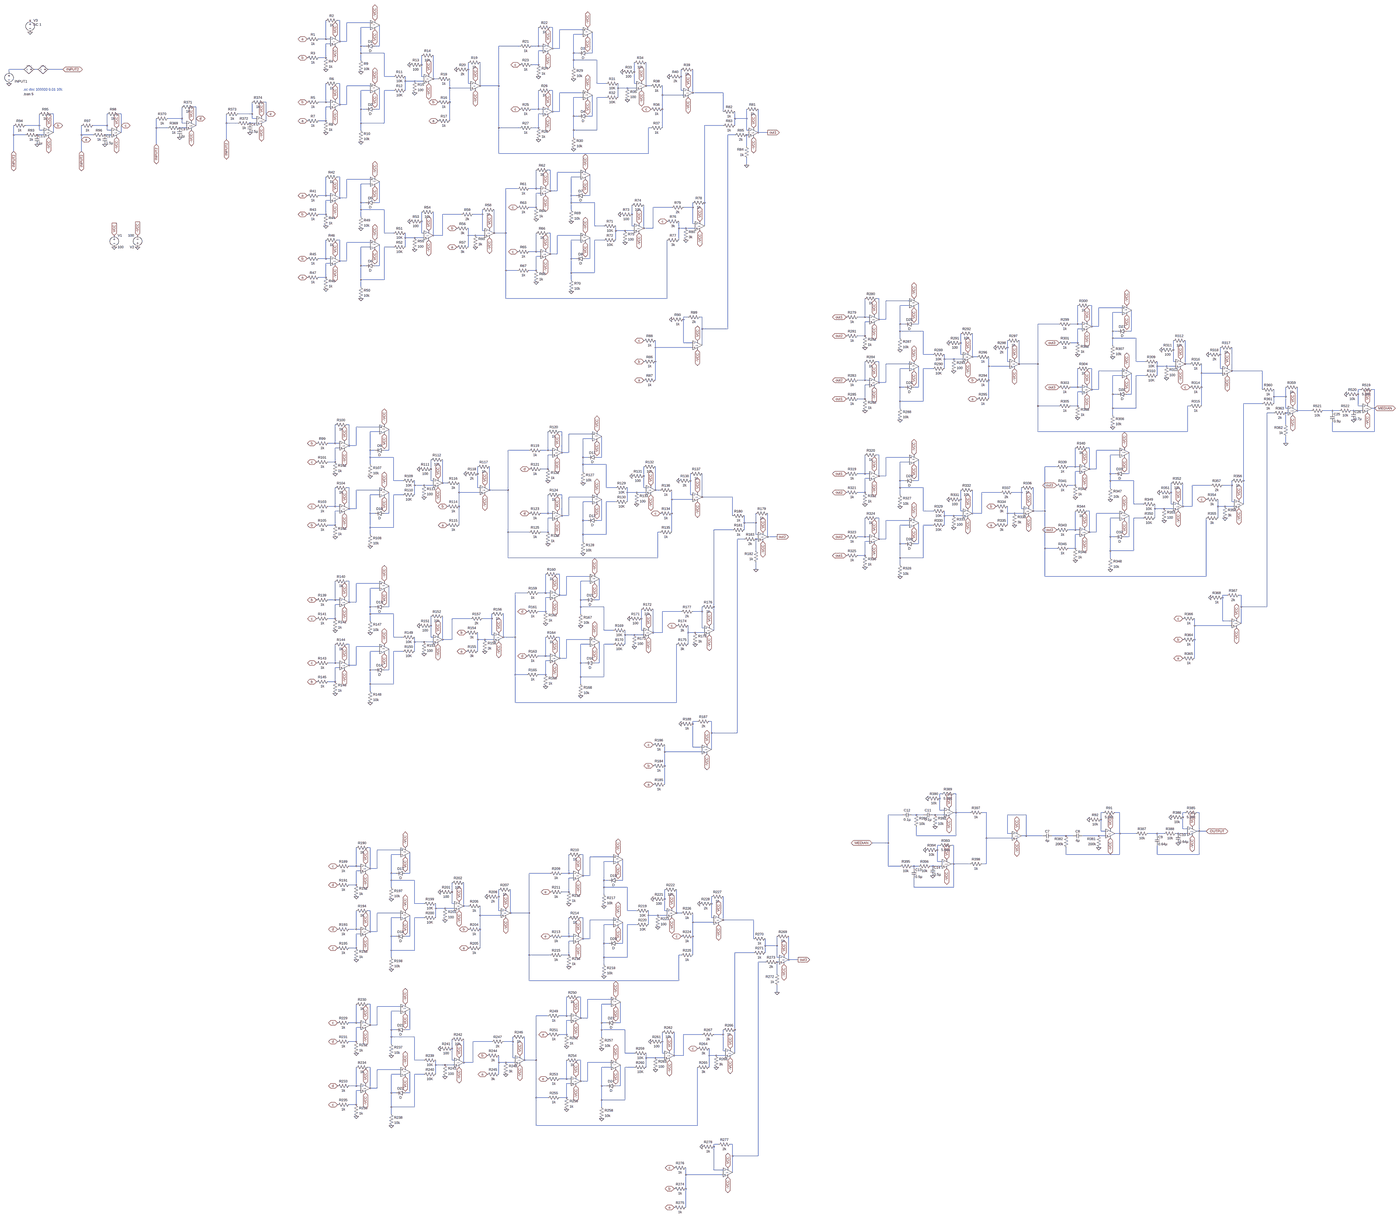
[diagram p0: schematic Final Circuit.asc, whole sheet]
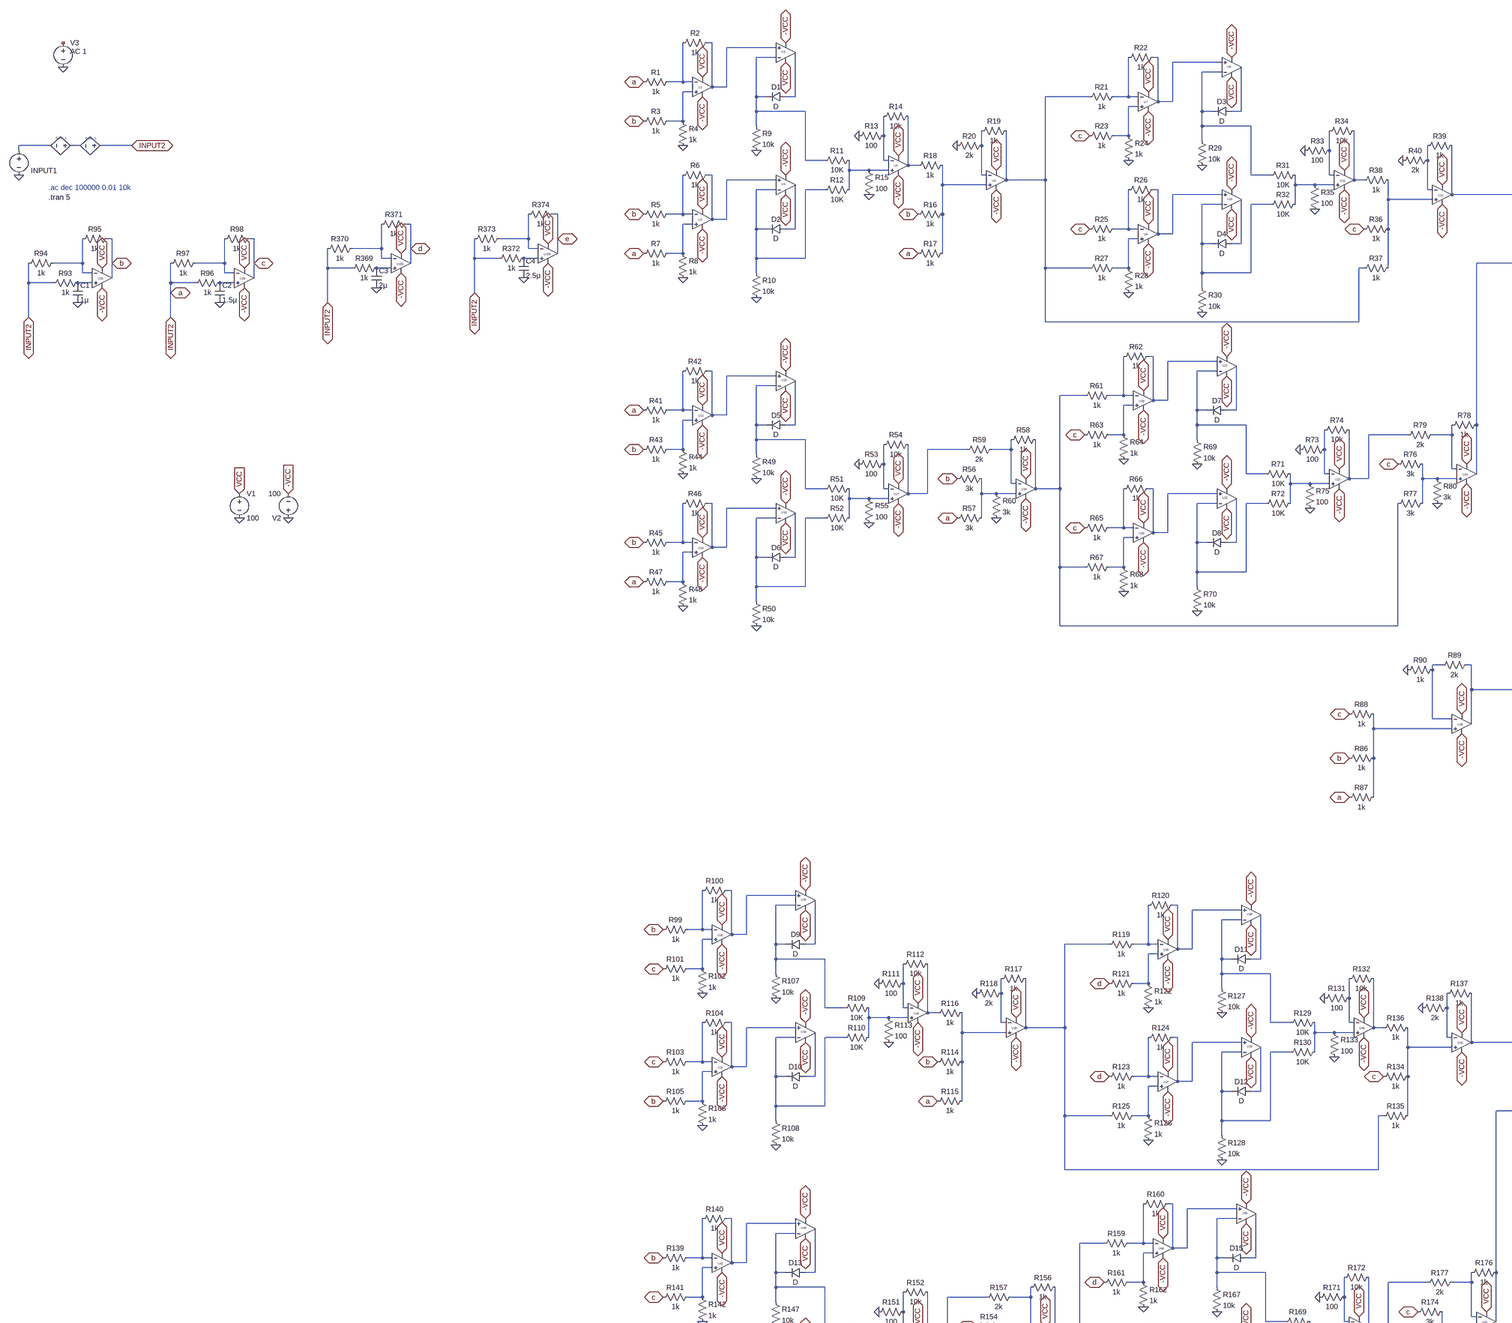
[diagram p1: schematic Final Circuit.asc, part, row 1 of 2, column 1 of 2]
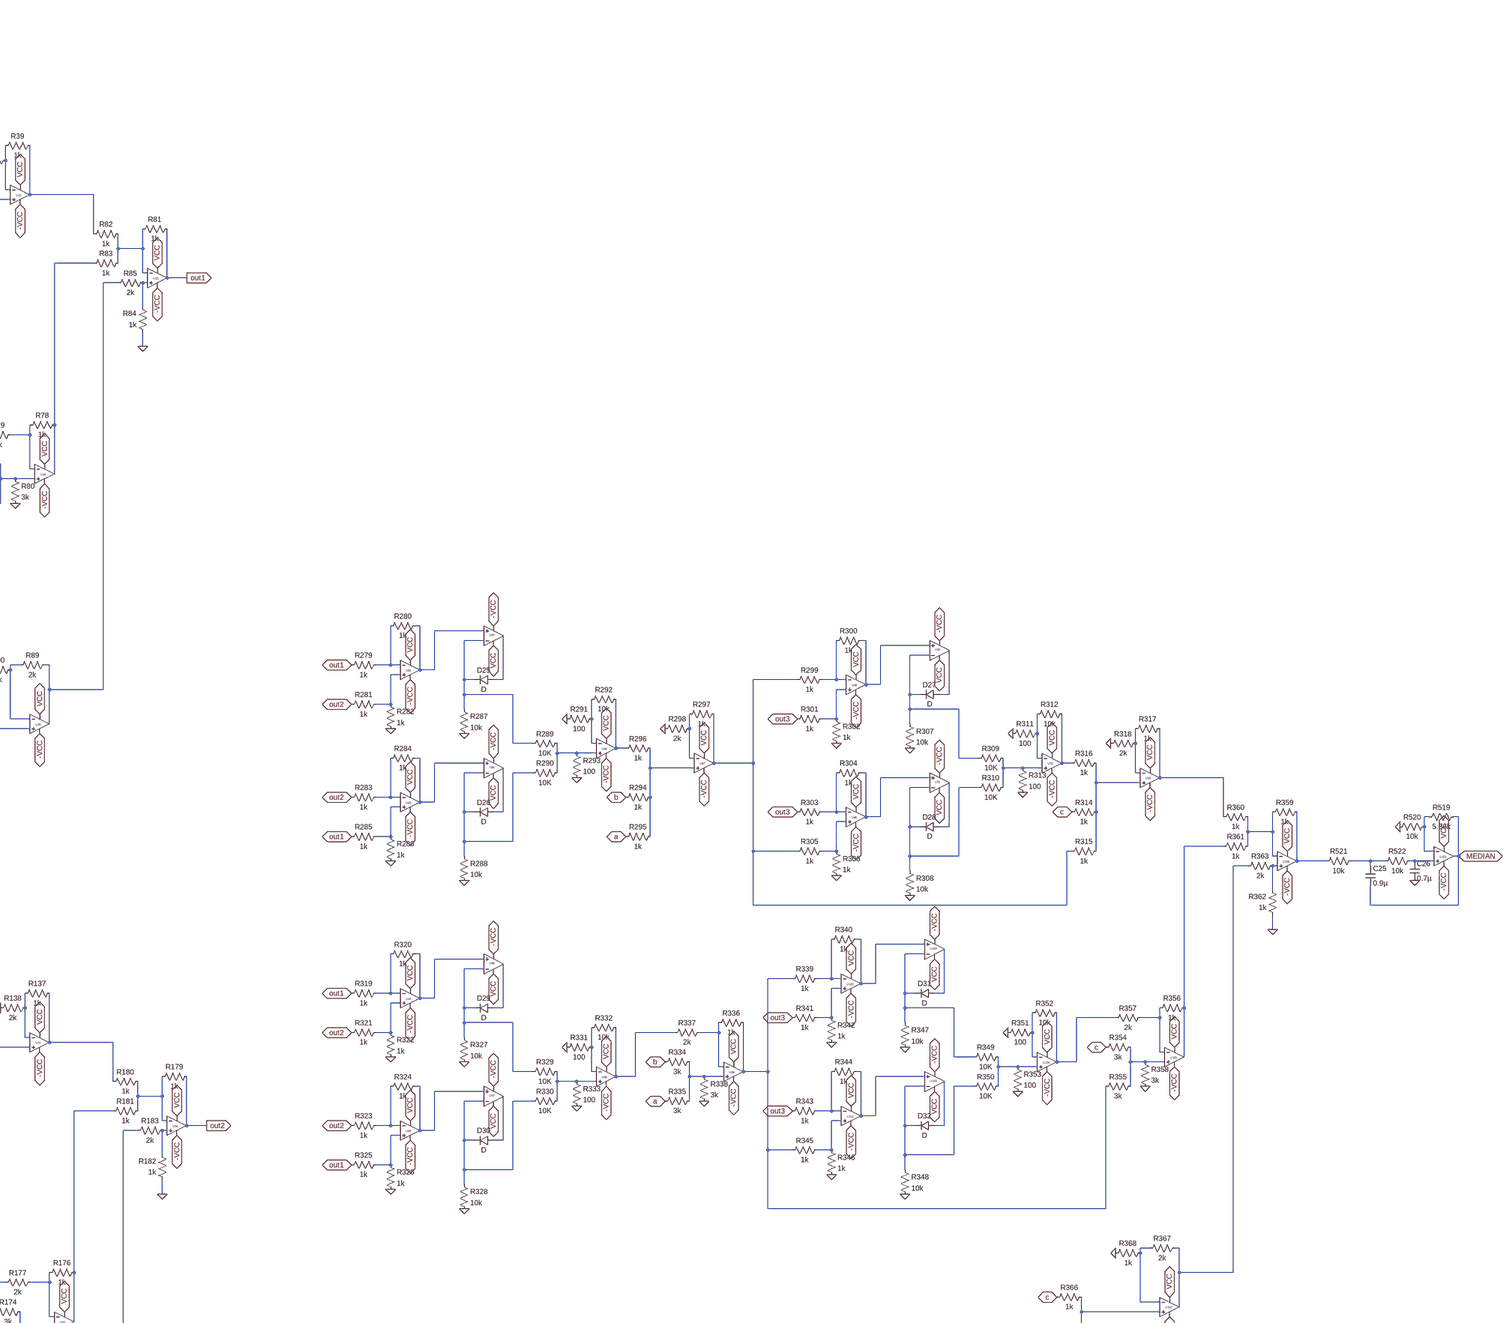
[diagram p2: schematic Final Circuit.asc, part, row 1 of 2, column 2 of 2]
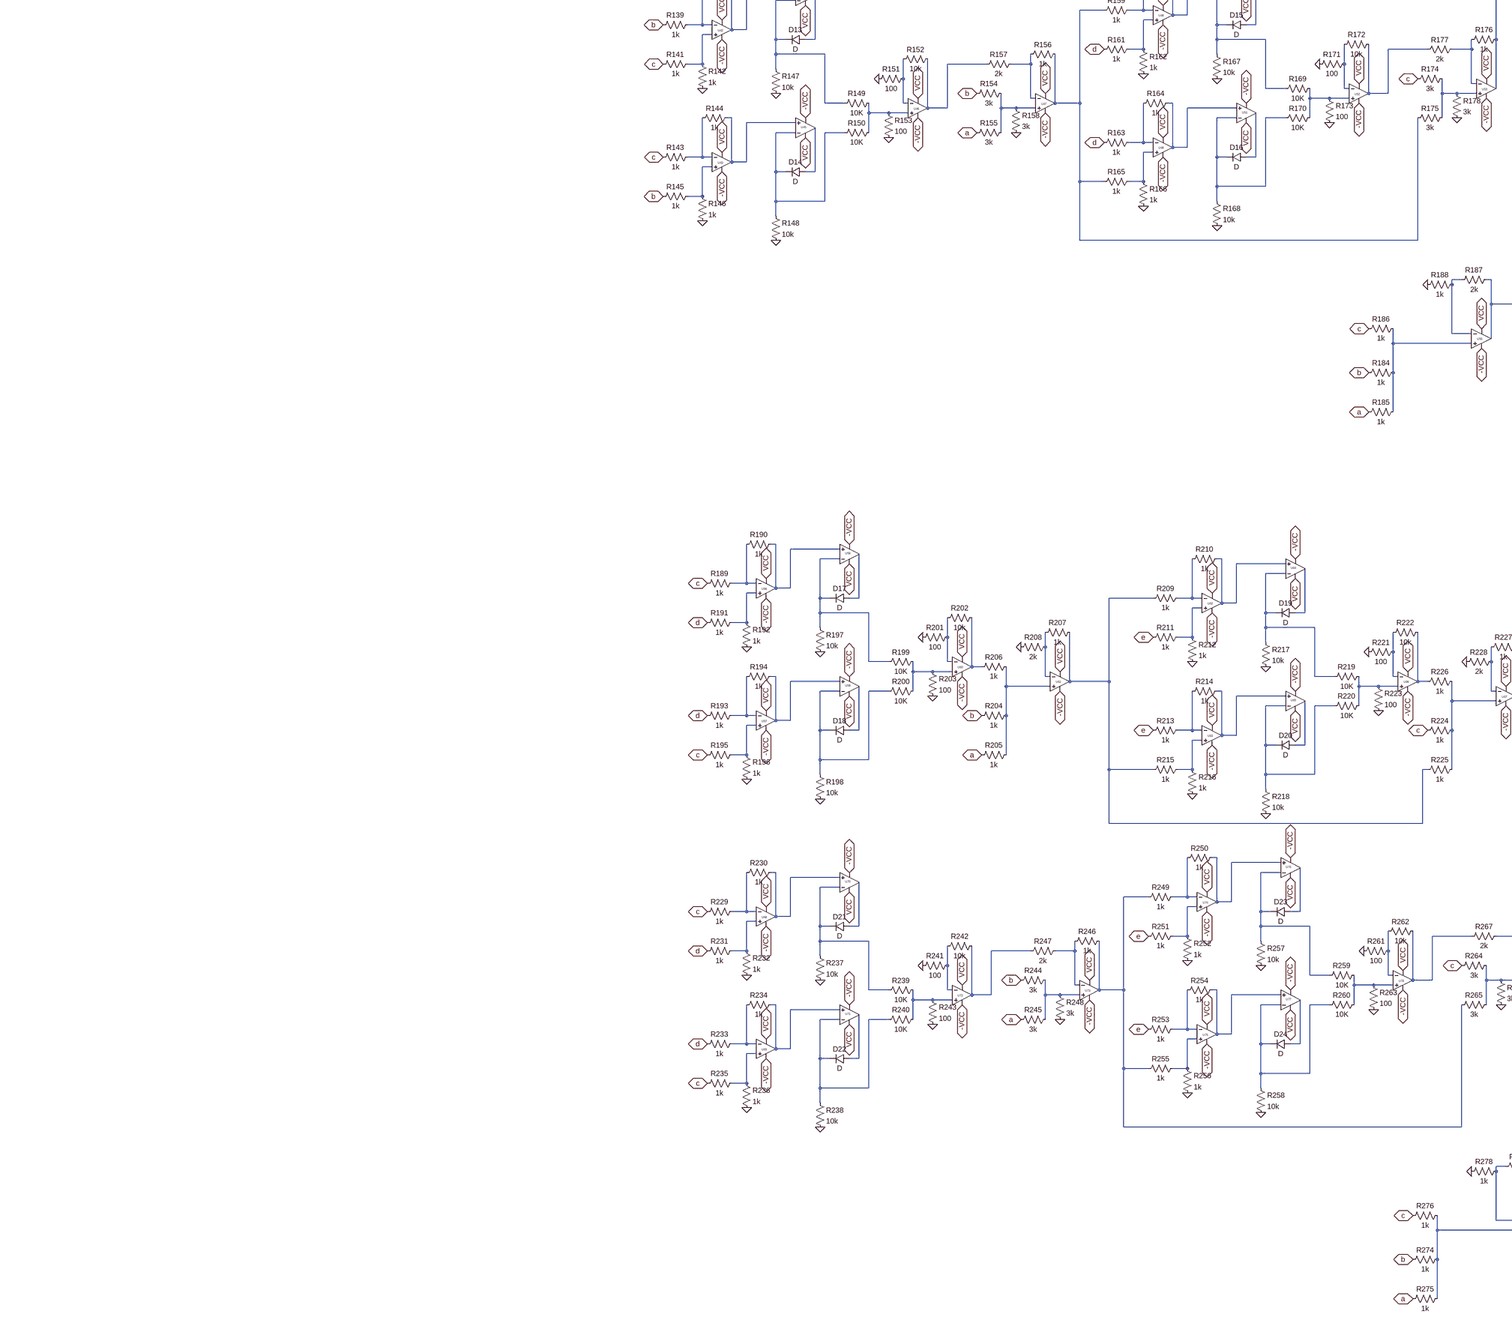
[diagram p3: schematic Final Circuit.asc, part, row 2 of 2, column 1 of 2]
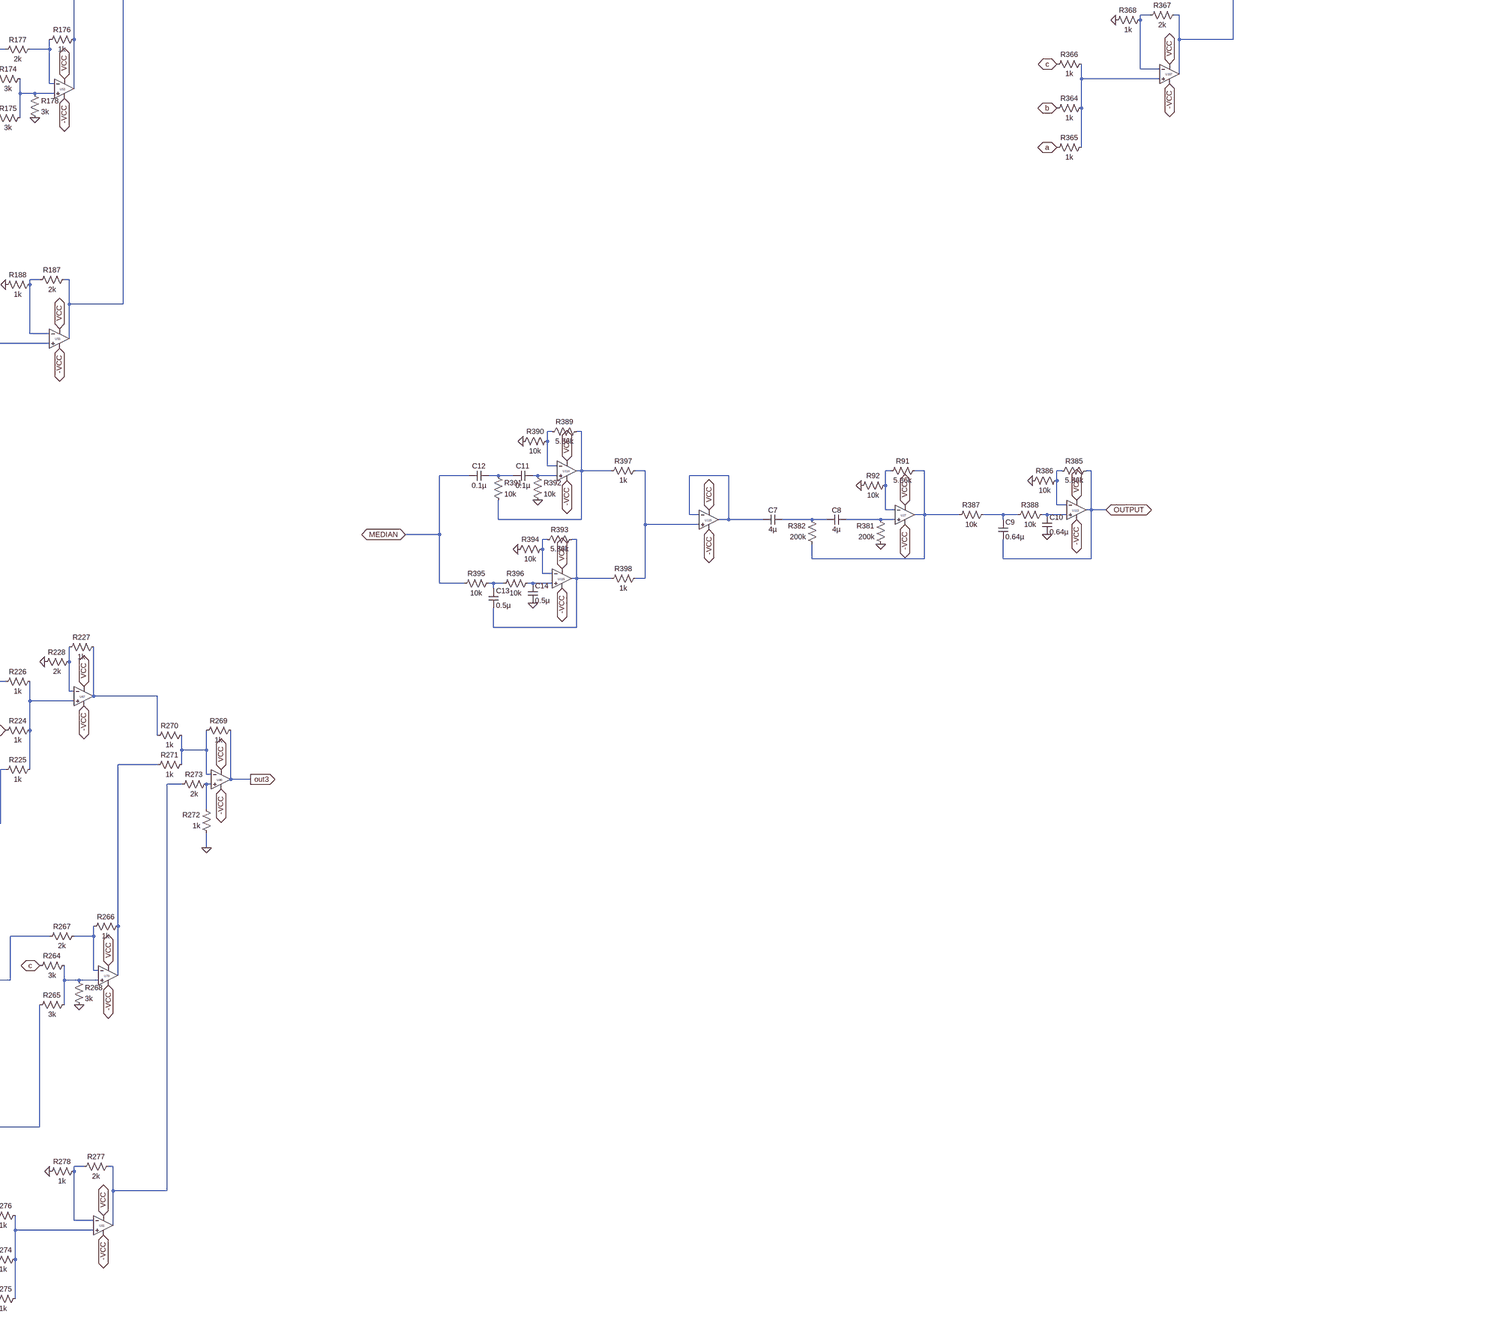
[diagram p4: schematic Final Circuit.asc, part, row 2 of 2, column 2 of 2]
* Final Circuit.asc
V1 VCC 0 100
V2 0 -VCC 100
XU1 N006 N005 VCC -VCC N001 level2 Avol=1Meg GBW=10Meg Slew=10Meg Ilimit=25m Rail=0 Vos=0 En=0 Enk=0 In=0 Ink=0 Rin=500Meg  ; pins In+ In- V+ V- OUT
R1 N005 INPUT2 1k
R2 N001 N005 1k
R3 N006 b 1k
R4 N006 0 1k
XU2 N030 N029 VCC -VCC N020 level2 Avol=1Meg GBW=10Meg Slew=10Meg Ilimit=25m Rail=0 Vos=0 En=0 Enk=0 In=0 Ink=0 Rin=500Meg  ; pins In+ In- V+ V- OUT
R5 N029 b 1k
R6 N020 N029 1k
R7 N030 INPUT2 1k
R8 N030 0 1k
XU3 N001 N002 VCC -VCC N007 level2 Avol=1Meg GBW=10Meg Slew=10Meg Ilimit=25m Rail=0 Vos=0 En=0 Enk=0 In=0 Ink=0 Rin=500Meg  ; pins In+ In- V+ V- OUT
R9 N002 0 10k
D1 N007 N002 D
XU4 N020 N024 VCC -VCC N031 level2 Avol=1Meg GBW=10Meg Slew=10Meg Ilimit=25m Rail=0 Vos=0 En=0 Enk=0 In=0 Ink=0 Rin=500Meg  ; pins In+ In- V+ V- OUT
R10 N024 0 10k
D2 N031 N024 D
R11 N019 N002 10K
R12 N019 N024 10K
XU5 N019 N012 VCC -VCC N018 level2 Avol=1Meg GBW=10Meg Slew=10Meg Ilimit=25m Rail=0 Vos=0 En=0 Enk=0 In=0 Ink=0 Rin=500Meg  ; pins In+ In- V+ V- OUT
R13 N012 0 100
R14 N018 N012 10k
R15 N019 0 100
R16 N022 b 1k
R17 N022 INPUT2 1k
R18 N022 N018 1k
XU6 N022 N015 VCC -VCC N008 level2 Avol=1Meg GBW=10Meg Slew=10Meg Ilimit=25m Rail=0 Vos=0 En=0 Enk=0 In=0 Ink=0 Rin=500Meg  ; pins In+ In- V+ V- OUT
R19 N008 N015 1k
R20 N015 0 2k
XU7 N010 N009 VCC -VCC N003 level2 Avol=1Meg GBW=10Meg Slew=10Meg Ilimit=25m Rail=0 Vos=0 En=0 Enk=0 In=0 Ink=0 Rin=500Meg  ; pins In+ In- V+ V- OUT
R21 N009 N008 1k
R22 N003 N009 1k
R23 N010 c 1k
R24 N010 0 1k
XU8 N034 N032 VCC -VCC N025 level2 Avol=1Meg GBW=10Meg Slew=10Meg Ilimit=25m Rail=0 Vos=0 En=0 Enk=0 In=0 Ink=0 Rin=500Meg  ; pins In+ In- V+ V- OUT
R25 N032 c 1k
R26 N025 N032 1k
R27 N034 N008 1k
R28 N034 0 1k
XU9 N003 N004 VCC -VCC N011 level2 Avol=1Meg GBW=10Meg Slew=10Meg Ilimit=25m Rail=0 Vos=0 En=0 Enk=0 In=0 Ink=0 Rin=500Meg  ; pins In+ In- V+ V- OUT
R29 N004 0 10k
D3 N011 N004 D
XU10 N025 N028 VCC -VCC N035 level2 Avol=1Meg GBW=10Meg Slew=10Meg Ilimit=25m Rail=0 Vos=0 En=0 Enk=0 In=0 Ink=0 Rin=500Meg  ; pins In+ In- V+ V- OUT
R30 N028 0 10k
D4 N035 N028 D
R31 N023 N004 10K
R32 N023 N028 10K
XU11 N023 N016 VCC -VCC N021 level2 Avol=1Meg GBW=10Meg Slew=10Meg Ilimit=25m Rail=0 Vos=0 En=0 Enk=0 In=0 Ink=0 Rin=500Meg  ; pins In+ In- V+ V- OUT
R33 N016 0 100
R34 N021 N016 10k
R35 N023 0 100
R36 N027 c 1k
R37 N027 N008 1k
R38 N027 N021 1k
XU12 N027 N017 VCC -VCC N026 level2 Avol=1Meg GBW=10Meg Slew=10Meg Ilimit=25m Rail=0 Vos=0 En=0 Enk=0 In=0 Ink=0 Rin=500Meg  ; pins In+ In- V+ V- OUT
R39 N026 N017 1k
R40 N017 0 2k
XU13 N056 N054 VCC -VCC N048 level2 Avol=1Meg GBW=10Meg Slew=10Meg Ilimit=25m Rail=0 Vos=0 En=0 Enk=0 In=0 Ink=0 Rin=500Meg  ; pins In+ In- V+ V- OUT
R41 N054 INPUT2 1k
R42 N048 N054 1k
R43 N056 b 1k
R44 N056 0 1k
XU14 N076 N074 VCC -VCC N069 level2 Avol=1Meg GBW=10Meg Slew=10Meg Ilimit=25m Rail=0 Vos=0 En=0 Enk=0 In=0 Ink=0 Rin=500Meg  ; pins In+ In- V+ V- OUT
R45 N074 b 1k
R46 N069 N074 1k
R47 N076 INPUT2 1k
R48 N076 0 1k
XU15 N048 N050 VCC -VCC N057 level2 Avol=1Meg GBW=10Meg Slew=10Meg Ilimit=25m Rail=0 Vos=0 En=0 Enk=0 In=0 Ink=0 Rin=500Meg  ; pins In+ In- V+ V- OUT
R49 N050 0 10k
D5 N057 N050 D
XU16 N069 N071 VCC -VCC N077 level2 Avol=1Meg GBW=10Meg Slew=10Meg Ilimit=25m Rail=0 Vos=0 En=0 Enk=0 In=0 Ink=0 Rin=500Meg  ; pins In+ In- V+ V- OUT
R50 N071 0 10k
D6 N077 N071 D
R51 N068 N050 10K
R52 N068 N071 10K
XU17 N068 N063 VCC -VCC N060 level2 Avol=1Meg GBW=10Meg Slew=10Meg Ilimit=25m Rail=0 Vos=0 En=0 Enk=0 In=0 Ink=0 Rin=500Meg  ; pins In+ In- V+ V- OUT
R53 N063 0 100
R54 N060 N063 10k
R55 N068 0 100
R56 N067 b 3k
R57 N067 INPUT2 3k
XU18 N067 N061 VCC -VCC N051 level2 Avol=1Meg GBW=10Meg Slew=10Meg Ilimit=25m Rail=0 Vos=0 En=0 Enk=0 In=0 Ink=0 Rin=500Meg  ; pins In+ In- V+ V- OUT
R58 N051 N061 1k
R59 N061 N060 2k
R60 N067 0 3k
XU19 N053 N052 VCC -VCC N047 level2 Avol=1Meg GBW=10Meg Slew=10Meg Ilimit=25m Rail=0 Vos=0 En=0 Enk=0 In=0 Ink=0 Rin=500Meg  ; pins In+ In- V+ V- OUT
R61 N052 N051 1k
R62 N047 N052 1k
R63 N053 c 1k
R64 N053 0 1k
XU20 N073 N072 VCC -VCC N066 level2 Avol=1Meg GBW=10Meg Slew=10Meg Ilimit=25m Rail=0 Vos=0 En=0 Enk=0 In=0 Ink=0 Rin=500Meg  ; pins In+ In- V+ V- OUT
R65 N072 c 1k
R66 N066 N072 1k
R67 N073 N051 1k
R68 N073 0 1k
XU21 N047 N049 VCC -VCC N055 level2 Avol=1Meg GBW=10Meg Slew=10Meg Ilimit=25m Rail=0 Vos=0 En=0 Enk=0 In=0 Ink=0 Rin=500Meg  ; pins In+ In- V+ V- OUT
R69 N049 0 10k
D7 N055 N049 D
XU22 N066 N070 VCC -VCC N075 level2 Avol=1Meg GBW=10Meg Slew=10Meg Ilimit=25m Rail=0 Vos=0 En=0 Enk=0 In=0 Ink=0 Rin=500Meg  ; pins In+ In- V+ V- OUT
R70 N070 0 10k
D8 N075 N070 D
R71 N065 N049 10K
R72 N065 N070 10K
XU23 N065 N062 VCC -VCC N058 level2 Avol=1Meg GBW=10Meg Slew=10Meg Ilimit=25m Rail=0 Vos=0 En=0 Enk=0 In=0 Ink=0 Rin=500Meg  ; pins In+ In- V+ V- OUT
R73 N062 0 100
R74 N058 N062 10k
R75 N065 0 100
R76 N064 c 3k
R77 N064 N051 3k
XU24 N064 N059 VCC -VCC N041 level2 Avol=1Meg GBW=10Meg Slew=10Meg Ilimit=25m Rail=0 Vos=0 En=0 Enk=0 In=0 Ink=0 Rin=500Meg  ; pins In+ In- V+ V- OUT
R78 N041 N059 1k
R79 N059 N058 2k
R80 N064 0 3k
XU25 N046 N037 VCC -VCC out1 level2 Avol=1Meg GBW=10Meg Slew=10Meg Ilimit=25m Rail=0 Vos=0 En=0 Enk=0 In=0 Ink=0 Rin=500Meg  ; pins In+ In- V+ V- OUT
R81 out1 N037 1k
R82 N037 N026 1k
R83 N037 N041 1k
R84 0 N046 1k
R85 N046 N045 2k
XU26 N091 N082 VCC -VCC N045 level2 Avol=1Meg GBW=10Meg Slew=10Meg Ilimit=25m Rail=0 Vos=0 En=0 Enk=0 In=0 Ink=0 Rin=500Meg  ; pins In+ In- V+ V- OUT
R86 N091 b 1k
R87 N091 INPUT2 1k
R88 N091 c 1k
R89 N045 N082 2k
R90 N082 0 1k
XU28 N043 N039 VCC -VCC b level2 Avol=1Meg GBW=10Meg Slew=10Meg Ilimit=25m Rail=0 Vos=0 En=0 Enk=0 In=0 Ink=0 Rin=500Meg  ; pins In+ In- V+ V- OUT
R93 N043 INPUT2 1k
C1 N043 0 1µ
R94 N039 INPUT2 1k
R95 b N039 1k
XU29 N044 N040 VCC -VCC c level2 Avol=1Meg GBW=10Meg Slew=10Meg Ilimit=25m Rail=0 Vos=0 En=0 Enk=0 In=0 Ink=0 Rin=500Meg  ; pins In+ In- V+ V- OUT
R96 N044 INPUT2 1k
C2 N044 0 1.5µ
R97 N040 INPUT2 1k
R98 c N040 1k
XU30 N125 N124 VCC -VCC N120 level2 Avol=1Meg GBW=10Meg Slew=10Meg Ilimit=25m Rail=0 Vos=0 En=0 Enk=0 In=0 Ink=0 Rin=500Meg  ; pins In+ In- V+ V- OUT
R99 N124 b 1k
R100 N120 N124 1k
R101 N125 c 1k
R102 N125 0 1k
XU31 N166 N163 VCC -VCC N150 level2 Avol=1Meg GBW=10Meg Slew=10Meg Ilimit=25m Rail=0 Vos=0 En=0 Enk=0 In=0 Ink=0 Rin=500Meg  ; pins In+ In- V+ V- OUT
R103 N163 c 1k
R104 N150 N163 1k
R105 N166 b 1k
R106 N166 0 1k
XU32 N120 N121 VCC -VCC N127 level2 Avol=1Meg GBW=10Meg Slew=10Meg Ilimit=25m Rail=0 Vos=0 En=0 Enk=0 In=0 Ink=0 Rin=500Meg  ; pins In+ In- V+ V- OUT
R107 N121 0 10k
D9 N127 N121 D
XU33 N150 N157 VCC -VCC N168 level2 Avol=1Meg GBW=10Meg Slew=10Meg Ilimit=25m Rail=0 Vos=0 En=0 Enk=0 In=0 Ink=0 Rin=500Meg  ; pins In+ In- V+ V- OUT
R108 N157 0 10k
D10 N168 N157 D
R109 N147 N121 10K
R110 N147 N157 10K
XU34 N147 N137 VCC -VCC N146 level2 Avol=1Meg GBW=10Meg Slew=10Meg Ilimit=25m Rail=0 Vos=0 En=0 Enk=0 In=0 Ink=0 Rin=500Meg  ; pins In+ In- V+ V- OUT
R111 N137 0 100
R112 N146 N137 10k
R113 N147 0 100
R114 N152 b 1k
R115 N152 INPUT2 1k
R116 N152 N146 1k
XU35 N152 N139 VCC -VCC N128 level2 Avol=1Meg GBW=10Meg Slew=10Meg Ilimit=25m Rail=0 Vos=0 En=0 Enk=0 In=0 Ink=0 Rin=500Meg  ; pins In+ In- V+ V- OUT
R117 N128 N139 1k
R118 N139 0 2k
XU36 N130 N129 VCC -VCC N122 level2 Avol=1Meg GBW=10Meg Slew=10Meg Ilimit=25m Rail=0 Vos=0 En=0 Enk=0 In=0 Ink=0 Rin=500Meg  ; pins In+ In- V+ V- OUT
R119 N129 N128 1k
R120 N122 N129 1k
R121 N130 d 1k
R122 N130 0 1k
XU37 N172 N169 VCC -VCC N158 level2 Avol=1Meg GBW=10Meg Slew=10Meg Ilimit=25m Rail=0 Vos=0 En=0 Enk=0 In=0 Ink=0 Rin=500Meg  ; pins In+ In- V+ V- OUT
R123 N169 d 1k
R124 N158 N169 1k
R125 N172 N128 1k
R126 N172 0 1k
XU38 N122 N123 VCC -VCC N133 level2 Avol=1Meg GBW=10Meg Slew=10Meg Ilimit=25m Rail=0 Vos=0 En=0 Enk=0 In=0 Ink=0 Rin=500Meg  ; pins In+ In- V+ V- OUT
R127 N123 0 10k
D11 N133 N123 D
XU39 N158 N162 VCC -VCC N175 level2 Avol=1Meg GBW=10Meg Slew=10Meg Ilimit=25m Rail=0 Vos=0 En=0 Enk=0 In=0 Ink=0 Rin=500Meg  ; pins In+ In- V+ V- OUT
R128 N162 0 10k
D12 N175 N162 D
R129 N153 N123 10K
R130 N153 N162 10K
XU40 N153 N142 VCC -VCC N151 level2 Avol=1Meg GBW=10Meg Slew=10Meg Ilimit=25m Rail=0 Vos=0 En=0 Enk=0 In=0 Ink=0 Rin=500Meg  ; pins In+ In- V+ V- OUT
R131 N142 0 100
R132 N151 N142 10k
R133 N153 0 100
R134 N160 c 1k
R135 N160 N128 1k
R136 N160 N151 1k
XU41 N160 N144 VCC -VCC N159 level2 Avol=1Meg GBW=10Meg Slew=10Meg Ilimit=25m Rail=0 Vos=0 En=0 Enk=0 In=0 Ink=0 Rin=500Meg  ; pins In+ In- V+ V- OUT
R137 N159 N144 1k
R138 N144 0 2k
XU42 N197 N195 VCC -VCC N188 level2 Avol=1Meg GBW=10Meg Slew=10Meg Ilimit=25m Rail=0 Vos=0 En=0 Enk=0 In=0 Ink=0 Rin=500Meg  ; pins In+ In- V+ V- OUT
R139 N195 b 1k
R140 N188 N195 1k
R141 N197 c 1k
R142 N197 0 1k
XU43 N218 N216 VCC -VCC N211 level2 Avol=1Meg GBW=10Meg Slew=10Meg Ilimit=25m Rail=0 Vos=0 En=0 Enk=0 In=0 Ink=0 Rin=500Meg  ; pins In+ In- V+ V- OUT
R143 N216 c 1k
R144 N211 N216 1k
R145 N218 b 1k
R146 N218 0 1k
XU44 N188 N190 VCC -VCC N198 level2 Avol=1Meg GBW=10Meg Slew=10Meg Ilimit=25m Rail=0 Vos=0 En=0 Enk=0 In=0 Ink=0 Rin=500Meg  ; pins In+ In- V+ V- OUT
R147 N190 0 10k
D13 N198 N190 D
XU45 N211 N213 VCC -VCC N219 level2 Avol=1Meg GBW=10Meg Slew=10Meg Ilimit=25m Rail=0 Vos=0 En=0 Enk=0 In=0 Ink=0 Rin=500Meg  ; pins In+ In- V+ V- OUT
R148 N213 0 10k
D14 N219 N213 D
R149 N210 N190 10K
R150 N210 N213 10K
XU46 N210 N204 VCC -VCC N201 level2 Avol=1Meg GBW=10Meg Slew=10Meg Ilimit=25m Rail=0 Vos=0 En=0 Enk=0 In=0 Ink=0 Rin=500Meg  ; pins In+ In- V+ V- OUT
R151 N204 0 100
R152 N201 N204 10k
R153 N210 0 100
R154 N209 b 3k
R155 N209 INPUT2 3k
XU47 N209 N202 VCC -VCC N191 level2 Avol=1Meg GBW=10Meg Slew=10Meg Ilimit=25m Rail=0 Vos=0 En=0 Enk=0 In=0 Ink=0 Rin=500Meg  ; pins In+ In- V+ V- OUT
R156 N191 N202 1k
R157 N202 N201 2k
R158 N209 0 3k
XU48 N194 N192 VCC -VCC N187 level2 Avol=1Meg GBW=10Meg Slew=10Meg Ilimit=25m Rail=0 Vos=0 En=0 Enk=0 In=0 Ink=0 Rin=500Meg  ; pins In+ In- V+ V- OUT
R159 N192 N191 1k
R160 N187 N192 1k
R161 N194 d 1k
R162 N194 0 1k
XU49 N215 N214 VCC -VCC N208 level2 Avol=1Meg GBW=10Meg Slew=10Meg Ilimit=25m Rail=0 Vos=0 En=0 Enk=0 In=0 Ink=0 Rin=500Meg  ; pins In+ In- V+ V- OUT
R163 N214 d 1k
R164 N208 N214 1k
R165 N215 N191 1k
R166 N215 0 1k
XU50 N187 N189 VCC -VCC N196 level2 Avol=1Meg GBW=10Meg Slew=10Meg Ilimit=25m Rail=0 Vos=0 En=0 Enk=0 In=0 Ink=0 Rin=500Meg  ; pins In+ In- V+ V- OUT
R167 N189 0 10k
D15 N196 N189 D
XU51 N208 N212 VCC -VCC N217 level2 Avol=1Meg GBW=10Meg Slew=10Meg Ilimit=25m Rail=0 Vos=0 En=0 Enk=0 In=0 Ink=0 Rin=500Meg  ; pins In+ In- V+ V- OUT
R168 N212 0 10k
D16 N217 N212 D
R169 N207 N189 10K
R170 N207 N212 10K
XU52 N207 N203 VCC -VCC N199 level2 Avol=1Meg GBW=10Meg Slew=10Meg Ilimit=25m Rail=0 Vos=0 En=0 Enk=0 In=0 Ink=0 Rin=500Meg  ; pins In+ In- V+ V- OUT
R171 N203 0 100
R172 N199 N203 10k
R173 N207 0 100
R174 N206 c 3k
R175 N206 N191 3k
XU53 N206 N200 VCC -VCC N178 level2 Avol=1Meg GBW=10Meg Slew=10Meg Ilimit=25m Rail=0 Vos=0 En=0 Enk=0 In=0 Ink=0 Rin=500Meg  ; pins In+ In- V+ V- OUT
R176 N178 N200 1k
R177 N200 N199 2k
R178 N206 0 3k
XU54 N184 N176 VCC -VCC out2 level2 Avol=1Meg GBW=10Meg Slew=10Meg Ilimit=25m Rail=0 Vos=0 En=0 Enk=0 In=0 Ink=0 Rin=500Meg  ; pins In+ In- V+ V- OUT
R179 out2 N176 1k
R180 N176 N159 1k
R181 N176 N178 1k
R182 0 N184 1k
R183 N184 N183 2k
XU55 N221 N220 VCC -VCC N183 level2 Avol=1Meg GBW=10Meg Slew=10Meg Ilimit=25m Rail=0 Vos=0 En=0 Enk=0 In=0 Ink=0 Rin=500Meg  ; pins In+ In- V+ V- OUT
R184 N221 b 1k
R185 N221 INPUT2 1k
R186 N221 c 1k
R187 N183 N220 2k
R188 N220 0 1k
XU56 N244 N241 VCC -VCC N237 level2 Avol=1Meg GBW=10Meg Slew=10Meg Ilimit=25m Rail=0 Vos=0 En=0 Enk=0 In=0 Ink=0 Rin=500Meg  ; pins In+ In- V+ V- OUT
R189 N241 c 1k
R190 N237 N241 1k
R191 N244 d 1k
R192 N244 0 1k
XU57 N266 N265 VCC -VCC N256 level2 Avol=1Meg GBW=10Meg Slew=10Meg Ilimit=25m Rail=0 Vos=0 En=0 Enk=0 In=0 Ink=0 Rin=500Meg  ; pins In+ In- V+ V- OUT
R193 N265 d 1k
R194 N256 N265 1k
R195 N266 c 1k
R196 N266 0 1k
XU58 N237 N238 VCC -VCC N245 level2 Avol=1Meg GBW=10Meg Slew=10Meg Ilimit=25m Rail=0 Vos=0 En=0 Enk=0 In=0 Ink=0 Rin=500Meg  ; pins In+ In- V+ V- OUT
R197 N238 0 10k
D17 N245 N238 D
XU59 N256 N260 VCC -VCC N267 level2 Avol=1Meg GBW=10Meg Slew=10Meg Ilimit=25m Rail=0 Vos=0 En=0 Enk=0 In=0 Ink=0 Rin=500Meg  ; pins In+ In- V+ V- OUT
R198 N260 0 10k
D18 N267 N260 D
R199 N255 N238 10K
R200 N255 N260 10K
XU60 N255 N250 VCC -VCC N254 level2 Avol=1Meg GBW=10Meg Slew=10Meg Ilimit=25m Rail=0 Vos=0 En=0 Enk=0 In=0 Ink=0 Rin=500Meg  ; pins In+ In- V+ V- OUT
R201 N250 0 100
R202 N254 N250 10k
R203 N255 0 100
R204 N258 b 1k
R205 N258 INPUT2 1k
R206 N258 N254 1k
XU61 N258 N251 VCC -VCC N246 level2 Avol=1Meg GBW=10Meg Slew=10Meg Ilimit=25m Rail=0 Vos=0 En=0 Enk=0 In=0 Ink=0 Rin=500Meg  ; pins In+ In- V+ V- OUT
R207 N246 N251 1k
R208 N251 0 2k
XU62 N248 N247 VCC -VCC N239 level2 Avol=1Meg GBW=10Meg Slew=10Meg Ilimit=25m Rail=0 Vos=0 En=0 Enk=0 In=0 Ink=0 Rin=500Meg  ; pins In+ In- V+ V- OUT
R209 N247 N246 1k
R210 N239 N247 1k
R211 N248 e 1k
R212 N248 0 1k
XU63 N269 N268 VCC -VCC N261 level2 Avol=1Meg GBW=10Meg Slew=10Meg Ilimit=25m Rail=0 Vos=0 En=0 Enk=0 In=0 Ink=0 Rin=500Meg  ; pins In+ In- V+ V- OUT
R213 N268 e 1k
R214 N261 N268 1k
R215 N269 N246 1k
R216 N269 0 1k
XU64 N239 N240 VCC -VCC N249 level2 Avol=1Meg GBW=10Meg Slew=10Meg Ilimit=25m Rail=0 Vos=0 En=0 Enk=0 In=0 Ink=0 Rin=500Meg  ; pins In+ In- V+ V- OUT
R217 N240 0 10k
D19 N249 N240 D
XU65 N261 N264 VCC -VCC N270 level2 Avol=1Meg GBW=10Meg Slew=10Meg Ilimit=25m Rail=0 Vos=0 En=0 Enk=0 In=0 Ink=0 Rin=500Meg  ; pins In+ In- V+ V- OUT
R218 N264 0 10k
D20 N270 N264 D
R219 N259 N240 10K
R220 N259 N264 10K
XU66 N259 N252 VCC -VCC N257 level2 Avol=1Meg GBW=10Meg Slew=10Meg Ilimit=25m Rail=0 Vos=0 En=0 Enk=0 In=0 Ink=0 Rin=500Meg  ; pins In+ In- V+ V- OUT
R221 N252 0 100
R222 N257 N252 10k
R223 N259 0 100
R224 N263 c 1k
R225 N263 N246 1k
R226 N263 N257 1k
XU67 N263 N253 VCC -VCC N262 level2 Avol=1Meg GBW=10Meg Slew=10Meg Ilimit=25m Rail=0 Vos=0 En=0 Enk=0 In=0 Ink=0 Rin=500Meg  ; pins In+ In- V+ V- OUT
R227 N262 N253 1k
R228 N253 0 2k
XU68 N284 N282 VCC -VCC N276 level2 Avol=1Meg GBW=10Meg Slew=10Meg Ilimit=25m Rail=0 Vos=0 En=0 Enk=0 In=0 Ink=0 Rin=500Meg  ; pins In+ In- V+ V- OUT
R229 N282 c 1k
R230 N276 N282 1k
R231 N284 d 1k
R232 N284 0 1k
XU69 N304 N302 VCC -VCC N297 level2 Avol=1Meg GBW=10Meg Slew=10Meg Ilimit=25m Rail=0 Vos=0 En=0 Enk=0 In=0 Ink=0 Rin=500Meg  ; pins In+ In- V+ V- OUT
R233 N302 d 1k
R234 N297 N302 1k
R235 N304 c 1k
R236 N304 0 1k
XU70 N276 N278 VCC -VCC N285 level2 Avol=1Meg GBW=10Meg Slew=10Meg Ilimit=25m Rail=0 Vos=0 En=0 Enk=0 In=0 Ink=0 Rin=500Meg  ; pins In+ In- V+ V- OUT
R237 N278 0 10k
D21 N285 N278 D
XU71 N297 N299 VCC -VCC N305 level2 Avol=1Meg GBW=10Meg Slew=10Meg Ilimit=25m Rail=0 Vos=0 En=0 Enk=0 In=0 Ink=0 Rin=500Meg  ; pins In+ In- V+ V- OUT
R238 N299 0 10k
D22 N305 N299 D
R239 N296 N278 10K
R240 N296 N299 10K
XU72 N296 N291 VCC -VCC N288 level2 Avol=1Meg GBW=10Meg Slew=10Meg Ilimit=25m Rail=0 Vos=0 En=0 Enk=0 In=0 Ink=0 Rin=500Meg  ; pins In+ In- V+ V- OUT
R241 N291 0 100
R242 N288 N291 10k
R243 N296 0 100
R244 N295 b 3k
R245 N295 INPUT2 3k
XU73 N295 N289 VCC -VCC N279 level2 Avol=1Meg GBW=10Meg Slew=10Meg Ilimit=25m Rail=0 Vos=0 En=0 Enk=0 In=0 Ink=0 Rin=500Meg  ; pins In+ In- V+ V- OUT
R246 N279 N289 1k
R247 N289 N288 2k
R248 N295 0 3k
XU74 N281 N280 VCC -VCC N275 level2 Avol=1Meg GBW=10Meg Slew=10Meg Ilimit=25m Rail=0 Vos=0 En=0 Enk=0 In=0 Ink=0 Rin=500Meg  ; pins In+ In- V+ V- OUT
R249 N280 N279 1k
R250 N275 N280 1k
R251 N281 e 1k
R252 N281 0 1k
XU75 N301 N300 VCC -VCC N294 level2 Avol=1Meg GBW=10Meg Slew=10Meg Ilimit=25m Rail=0 Vos=0 En=0 Enk=0 In=0 Ink=0 Rin=500Meg  ; pins In+ In- V+ V- OUT
R253 N300 e 1k
R254 N294 N300 1k
R255 N301 N279 1k
R256 N301 0 1k
XU76 N275 N277 VCC -VCC N283 level2 Avol=1Meg GBW=10Meg Slew=10Meg Ilimit=25m Rail=0 Vos=0 En=0 Enk=0 In=0 Ink=0 Rin=500Meg  ; pins In+ In- V+ V- OUT
R257 N277 0 10k
D23 N283 N277 D
XU77 N294 N298 VCC -VCC N303 level2 Avol=1Meg GBW=10Meg Slew=10Meg Ilimit=25m Rail=0 Vos=0 En=0 Enk=0 In=0 Ink=0 Rin=500Meg  ; pins In+ In- V+ V- OUT
R258 N298 0 10k
D24 N303 N298 D
R259 N293 N277 10K
R260 N293 N298 10K
XU78 N293 N290 VCC -VCC N286 level2 Avol=1Meg GBW=10Meg Slew=10Meg Ilimit=25m Rail=0 Vos=0 En=0 Enk=0 In=0 Ink=0 Rin=500Meg  ; pins In+ In- V+ V- OUT
R261 N290 0 100
R262 N286 N290 10k
R263 N293 0 100
R264 N292 c 3k
R265 N292 N279 3k
XU79 N292 N287 VCC -VCC N272 level2 Avol=1Meg GBW=10Meg Slew=10Meg Ilimit=25m Rail=0 Vos=0 En=0 Enk=0 In=0 Ink=0 Rin=500Meg  ; pins In+ In- V+ V- OUT
R266 N272 N287 1k
R267 N287 N286 2k
R268 N292 0 3k
XU80 N274 N271 VCC -VCC out3 level2 Avol=1Meg GBW=10Meg Slew=10Meg Ilimit=25m Rail=0 Vos=0 En=0 Enk=0 In=0 Ink=0 Rin=500Meg  ; pins In+ In- V+ V- OUT
R269 out3 N271 1k
R270 N271 N262 1k
R271 N271 N272 1k
R272 0 N274 1k
R273 N274 N273 2k
XU81 N307 N306 VCC -VCC N273 level2 Avol=1Meg GBW=10Meg Slew=10Meg Ilimit=25m Rail=0 Vos=0 En=0 Enk=0 In=0 Ink=0 Rin=500Meg  ; pins In+ In- V+ V- OUT
R274 N307 b 1k
R275 N307 INPUT2 1k
R276 N307 c 1k
R277 N273 N306 2k
R278 N306 0 1k
XU82 N084 N083 VCC -VCC N078 level2 Avol=1Meg GBW=10Meg Slew=10Meg Ilimit=25m Rail=0 Vos=0 En=0 Enk=0 In=0 Ink=0 Rin=500Meg  ; pins In+ In- V+ V- OUT
R279 N083 out1 1k
R280 N078 N083 1k
R281 N084 out2 1k
R282 N084 0 1k
XU83 N107 N106 VCC -VCC N097 level2 Avol=1Meg GBW=10Meg Slew=10Meg Ilimit=25m Rail=0 Vos=0 En=0 Enk=0 In=0 Ink=0 Rin=500Meg  ; pins In+ In- V+ V- OUT
R283 N106 out2 1k
R284 N097 N106 1k
R285 N107 out1 1k
R286 N107 0 1k
XU84 N078 N079 VCC -VCC N085 level2 Avol=1Meg GBW=10Meg Slew=10Meg Ilimit=25m Rail=0 Vos=0 En=0 Enk=0 In=0 Ink=0 Rin=500Meg  ; pins In+ In- V+ V- OUT
R287 N079 0 10k
D25 N085 N079 D
XU85 N097 N101 VCC -VCC N108 level2 Avol=1Meg GBW=10Meg Slew=10Meg Ilimit=25m Rail=0 Vos=0 En=0 Enk=0 In=0 Ink=0 Rin=500Meg  ; pins In+ In- V+ V- OUT
R288 N101 0 10k
D26 N108 N101 D
R289 N096 N079 10K
R290 N096 N101 10K
XU86 N096 N090 VCC -VCC N095 level2 Avol=1Meg GBW=10Meg Slew=10Meg Ilimit=25m Rail=0 Vos=0 En=0 Enk=0 In=0 Ink=0 Rin=500Meg  ; pins In+ In- V+ V- OUT
R291 N090 0 100
R292 N095 N090 10k
R293 N096 0 100
R294 N099 b 1k
R295 N099 INPUT2 1k
R296 N099 N095 1k
XU87 N099 N092 VCC -VCC N086 level2 Avol=1Meg GBW=10Meg Slew=10Meg Ilimit=25m Rail=0 Vos=0 En=0 Enk=0 In=0 Ink=0 Rin=500Meg  ; pins In+ In- V+ V- OUT
R297 N086 N092 1k
R298 N092 0 2k
XU88 N088 N087 VCC -VCC N080 level2 Avol=1Meg GBW=10Meg Slew=10Meg Ilimit=25m Rail=0 Vos=0 En=0 Enk=0 In=0 Ink=0 Rin=500Meg  ; pins In+ In- V+ V- OUT
R299 N087 N086 1k
R300 N080 N087 1k
R301 N088 out3 1k
R302 N088 0 1k
XU89 N111 N109 VCC -VCC N102 level2 Avol=1Meg GBW=10Meg Slew=10Meg Ilimit=25m Rail=0 Vos=0 En=0 Enk=0 In=0 Ink=0 Rin=500Meg  ; pins In+ In- V+ V- OUT
R303 N109 out3 1k
R304 N102 N109 1k
R305 N111 N086 1k
R306 N111 0 1k
XU90 N080 N081 VCC -VCC N089 level2 Avol=1Meg GBW=10Meg Slew=10Meg Ilimit=25m Rail=0 Vos=0 En=0 Enk=0 In=0 Ink=0 Rin=500Meg  ; pins In+ In- V+ V- OUT
R307 N081 0 10k
D27 N089 N081 D
XU91 N102 N105 VCC -VCC N112 level2 Avol=1Meg GBW=10Meg Slew=10Meg Ilimit=25m Rail=0 Vos=0 En=0 Enk=0 In=0 Ink=0 Rin=500Meg  ; pins In+ In- V+ V- OUT
R308 N105 0 10k
D28 N112 N105 D
R309 N100 N081 10K
R310 N100 N105 10K
XU92 N100 N093 VCC -VCC N098 level2 Avol=1Meg GBW=10Meg Slew=10Meg Ilimit=25m Rail=0 Vos=0 En=0 Enk=0 In=0 Ink=0 Rin=500Meg  ; pins In+ In- V+ V- OUT
R311 N093 0 100
R312 N098 N093 10k
R313 N100 0 100
R314 N104 c 1k
R315 N104 N086 1k
R316 N104 N098 1k
XU93 N104 N094 VCC -VCC N103 level2 Avol=1Meg GBW=10Meg Slew=10Meg Ilimit=25m Rail=0 Vos=0 En=0 Enk=0 In=0 Ink=0 Rin=500Meg  ; pins In+ In- V+ V- OUT
R317 N103 N094 1k
R318 N094 0 2k
XU94 N143 N140 VCC -VCC N131 level2 Avol=1Meg GBW=10Meg Slew=10Meg Ilimit=25m Rail=0 Vos=0 En=0 Enk=0 In=0 Ink=0 Rin=500Meg  ; pins In+ In- V+ V- OUT
R319 N140 out1 1k
R320 N131 N140 1k
R321 N143 out2 1k
R322 N143 0 1k
XU95 N185 N181 VCC -VCC N173 level2 Avol=1Meg GBW=10Meg Slew=10Meg Ilimit=25m Rail=0 Vos=0 En=0 Enk=0 In=0 Ink=0 Rin=500Meg  ; pins In+ In- V+ V- OUT
R323 N181 out2 1k
R324 N173 N181 1k
R325 N185 out1 1k
R326 N185 0 1k
XU96 N131 N134 VCC -VCC N145 level2 Avol=1Meg GBW=10Meg Slew=10Meg Ilimit=25m Rail=0 Vos=0 En=0 Enk=0 In=0 Ink=0 Rin=500Meg  ; pins In+ In- V+ V- OUT
R327 N134 0 10k
D29 N145 N134 D
XU97 N173 N177 VCC -VCC N186 level2 Avol=1Meg GBW=10Meg Slew=10Meg Ilimit=25m Rail=0 Vos=0 En=0 Enk=0 In=0 Ink=0 Rin=500Meg  ; pins In+ In- V+ V- OUT
R328 N177 0 10k
D30 N186 N177 D
R329 N171 N134 10K
R330 N171 N177 10K
XU98 N171 N161 VCC -VCC N154 level2 Avol=1Meg GBW=10Meg Slew=10Meg Ilimit=25m Rail=0 Vos=0 En=0 Enk=0 In=0 Ink=0 Rin=500Meg  ; pins In+ In- V+ V- OUT
R331 N161 0 100
R332 N154 N161 10k
R333 N171 0 100
R334 N170 b 3k
R335 N170 INPUT2 3k
XU99 N170 N155 VCC -VCC N135 level2 Avol=1Meg GBW=10Meg Slew=10Meg Ilimit=25m Rail=0 Vos=0 En=0 Enk=0 In=0 Ink=0 Rin=500Meg  ; pins In+ In- V+ V- OUT
R336 N135 N155 1k
R337 N155 N154 2k
R338 N170 0 3k
XU100 N138 N136 VCC -VCC N126 level2 Avol=1Meg GBW=10Meg Slew=10Meg Ilimit=25m Rail=0 Vos=0 En=0 Enk=0 In=0 Ink=0 Rin=500Meg  ; pins In+ In- V+ V- OUT
R339 N136 N135 1k
R340 N126 N136 1k
R341 N138 out3 1k
R342 N138 0 1k
XU101 N180 N179 VCC -VCC N167 level2 Avol=1Meg GBW=10Meg Slew=10Meg Ilimit=25m Rail=0 Vos=0 En=0 Enk=0 In=0 Ink=0 Rin=500Meg  ; pins In+ In- V+ V- OUT
R343 N179 out3 1k
R344 N167 N179 1k
R345 N180 N135 1k
R346 N180 0 1k
XU102 N126 N132 VCC -VCC N141 level2 Avol=1Meg GBW=10Meg Slew=10Meg Ilimit=25m Rail=0 Vos=0 En=0 Enk=0 In=0 Ink=0 Rin=500Meg  ; pins In+ In- V+ V- OUT
R347 N132 0 10k
D31 N141 N132 D
XU103 N167 N174 VCC -VCC N182 level2 Avol=1Meg GBW=10Meg Slew=10Meg Ilimit=25m Rail=0 Vos=0 En=0 Enk=0 In=0 Ink=0 Rin=500Meg  ; pins In+ In- V+ V- OUT
R348 N174 0 10k
D32 N182 N174 D
R349 N165 N132 10K
R350 N165 N174 10K
XU104 N165 N156 VCC -VCC N148 level2 Avol=1Meg GBW=10Meg Slew=10Meg Ilimit=25m Rail=0 Vos=0 En=0 Enk=0 In=0 Ink=0 Rin=500Meg  ; pins In+ In- V+ V- OUT
R351 N156 0 100
R352 N148 N156 10k
R353 N165 0 100
R354 N164 c 3k
R355 N164 N135 3k
XU105 N164 N149 VCC -VCC N114 level2 Avol=1Meg GBW=10Meg Slew=10Meg Ilimit=25m Rail=0 Vos=0 En=0 Enk=0 In=0 Ink=0 Rin=500Meg  ; pins In+ In- V+ V- OUT
R356 N114 N149 1k
R357 N149 N148 2k
R358 N164 0 3k
XU106 N119 N113 VCC -VCC N115 level2 Avol=1Meg GBW=10Meg Slew=10Meg Ilimit=25m Rail=0 Vos=0 En=0 Enk=0 In=0 Ink=0 Rin=500Meg  ; pins In+ In- V+ V- OUT
R359 N115 N113 1k
R360 N113 N103 1k
R361 N113 N114 1k
R362 0 N119 1k
R363 N119 N118 2k
XU107 N205 N193 VCC -VCC N118 level2 Avol=1Meg GBW=10Meg Slew=10Meg Ilimit=25m Rail=0 Vos=0 En=0 Enk=0 In=0 Ink=0 Rin=500Meg  ; pins In+ In- V+ V- OUT
R364 N205 b 1k
R365 N205 INPUT2 1k
R366 N205 c 1k
R367 N118 N193 2k
R368 N193 0 1k
XU108 N042 N036 VCC -VCC d level2 Avol=1Meg GBW=10Meg Slew=10Meg Ilimit=25m Rail=0 Vos=0 En=0 Enk=0 In=0 Ink=0 Rin=500Meg  ; pins In+ In- V+ V- OUT
R369 N042 INPUT2 1k
C3 N042 0 2µ
R370 N036 INPUT2 1k
R371 d N036 1k
XU109 N038 N033 VCC -VCC e level2 Avol=1Meg GBW=10Meg Slew=10Meg Ilimit=25m Rail=0 Vos=0 En=0 Enk=0 In=0 Ink=0 Rin=500Meg  ; pins In+ In- V+ V- OUT
R372 N038 INPUT2 1k
C4 N038 0 2.5µ
R373 N033 INPUT2 1k
R374 e N033 1k
XU27 N234 N225 VCC -VCC N226 level2 Avol=1Meg GBW=10Meg Slew=10Meg Ilimit=25m Rail=0 Vos=0 En=0 Enk=0 In=0 Ink=0 Rin=500Meg  ; pins In+ In- V+ V- OUT
R91 N226 N225 5.86k
R92 N225 0 10k
R381 0 N234 200k
C7 N233 N230 4µ
C8 N234 N233 4µ
R382 N226 N233 200k
V§INPUT1 N013 0 PWL file=data.txt
XU113 N232 N227 VCC -VCC OUTPUT level2 Avol=1Meg GBW=10Meg Slew=10Meg Ilimit=25m Rail=0 Vos=0 En=0 Enk=0 In=0 Ink=0 Rin=500Meg  ; pins In+ In- V+ V- OUT
R385 N227 OUTPUT 5.86k
R386 0 N227 10k
R387 N231 N226 10k
R388 N232 N231 10k
C9 N231 OUTPUT 0.64µ
C10 N232 0 0.64µ
B§Noise_1 N014 N013 V=WHITE(314*time)*0.0002
B§Nosie_1 INPUT2 N014 V= idt(white(0.628*time))*0.00001
XU114 N229 N222 VCC -VCC N223 level2 Avol=1Meg GBW=10Meg Slew=10Meg Ilimit=25m Rail=0 Vos=0 En=0 Enk=0 In=0 Ink=0 Rin=500Meg  ; pins In+ In- V+ V- OUT
R389 N222 N223 5.86k
R390 0 N222 10k
R391 N228 N223 10k
R392 N229 0 10k
C11 N229 N228 0.1µ
C12 N228 MEDIAN 0.1µ
XU115 N243 N235 VCC -VCC N236 level2 Avol=1Meg GBW=10Meg Slew=10Meg Ilimit=25m Rail=0 Vos=0 En=0 Enk=0 In=0 Ink=0 Rin=500Meg  ; pins In+ In- V+ V- OUT
R393 N235 N236 5.86k
R394 0 N235 10k
R395 N242 MEDIAN 10k
R396 N243 N242 10k
C13 N242 N236 0.5µ
C14 N243 0 0.5µ
XU116 N224 N230 VCC -VCC N230 level2 Avol=1Meg GBW=10Meg Slew=10Meg Ilimit=25m Rail=0 Vos=0 En=0 Enk=0 In=0 Ink=0 Rin=500Meg  ; pins In+ In- V+ V- OUT
R397 N224 N223 1k
R398 N224 N236 1k
V3 NC_01 0 AC 1
XU151 N117 N110 VCC -VCC MEDIAN level2 Avol=1Meg GBW=10Meg Slew=10Meg Ilimit=25m Rail=0 Vos=0 En=0 Enk=0 In=0 Ink=0 Rin=500Meg  ; pins In+ In- V+ V- OUT
R519 N110 MEDIAN 5.86k
R520 0 N110 10k
R521 N116 N115 10k
R522 N117 N116 10k
C25 N116 MEDIAN 0.9µ
C26 N117 0 0.7µ
.model D D
.lib standard.dio
.tran 5
* .ac dec 100000 0.01 10k
.lib UniversalOpAmp2.lib
.backanno
.end